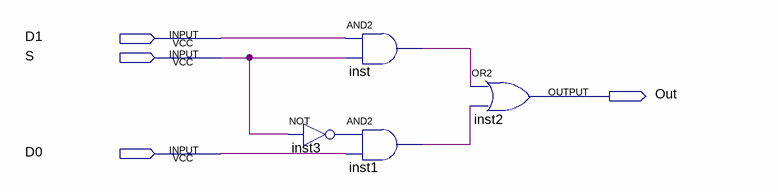
[diagram p0: schematic sheet]
// Quartus schematic Mux.bdf as structural Verilog: 4 symbols, 4 pins
module Mux (
  input  D1,
  input  S,
  input  D0,
  output Out
);

  wire inst1_out, inst3_out, inst_out;

  and inst (inst_out, D1, S);
  and inst1 (inst1_out, inst3_out, D0);
  not inst3 (inst3_out, S);
  or inst2 (Out, inst_out, inst1_out);
endmodule
